# Altium project IBB.PrjPcb (part 9 of 12)
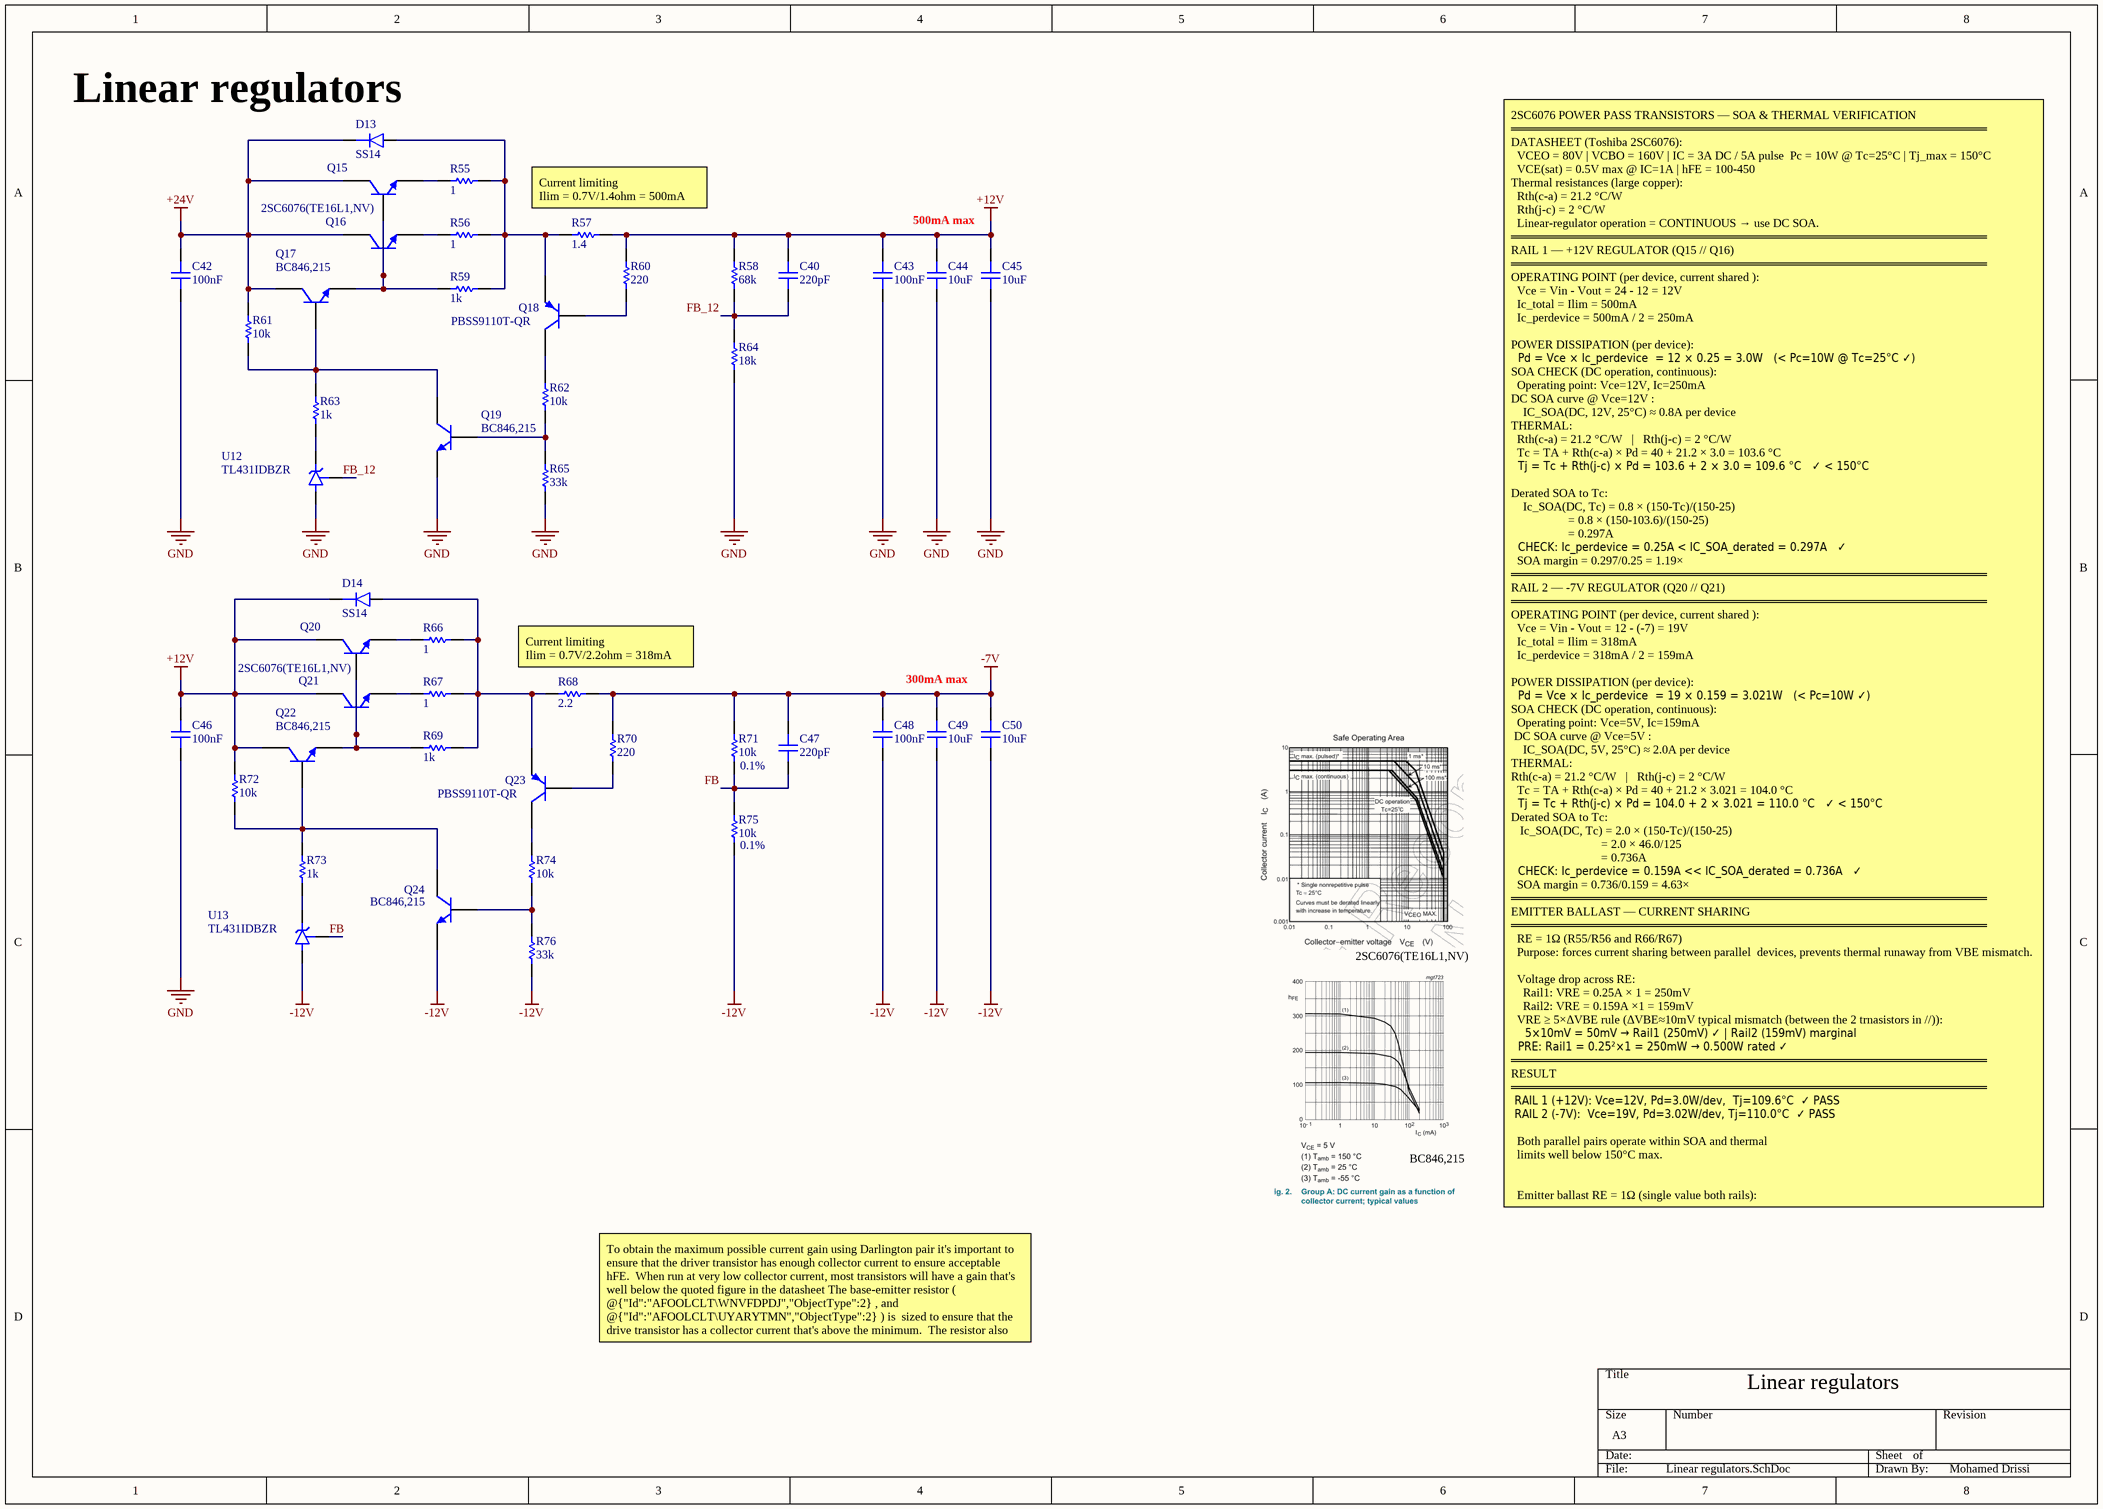
[diagram p14: Linear regulators.SchDoc]

## Sheet Linear regulators.SchDoc (continued)

### Library data of the parts (continued)
R68 = Bourns CRM1206-JW-2R2ELF: Res Thick Film 1206 2.2 Ohm 5% 0.5W(1/2W) ±200ppm/C Pad SMD T/R; Manufacturer: Bourns; Max Power Dissipation: 500mW; Temperature Coefficient: 200ppm/°C; Voltage Rating: 200V; Supplier: RS; Supplier Part Number: 630160; Manufacturer Part Number: CRM1206-JW-2R2ELF; RoHS: Compliant; Category: Chip SMD Resistors; Stock: 9920; Pricing: 20=0,049, 500=0,042, 2000=0,032, 10000=0,028, 20000=0,021 (EUR); Case/Package: 1206; Case Code (Imperial): 1206; Case Code (Metric): 3216; China RoHS: Non-Compliant; Composition: Thick Film; Country of Origin: Taiwan; Depth: 1.6mm; Export Control Classification Number (ECCN) Code: EAR99; Height: 550µm; Harmonized Tariff Schedule (HTS) Code: 8533.21.00.30; Introduction Date: 2011-02-17; Length: 3.1mm; Lifecycle Status: Production; Max Operating Temperature: 155°C; Military Standard: Not; Min Operating Temperature: -55°C; Mounting Technology: Surface Mount; Pins: 2; Number of Terminals: 2; Number of Terminations: 2; Packaging: Cut Tape; Power Rating: 500mW; REACH SVHC: Yes; Schedule B: 8533210045, 8533210045|8533210045, 8533210045|8533210045|8533210045, 8533210045|8533210045|8533210045|8533210045; Tolerance: 5%; Voltage Rating (DC): 200V; Width: 1.6mm; Working Voltage: 200V; ComponentLink1URL: https://datasheet.octopart.com:443/CRM1206-JW-2R2ELF-Bourns-datasheet-182141858.pdf?src-supplier=Master+Electronics; ComponentLink1Description: https://datasheet.octopart.com:443/CRM1206-JW-2R2ELF-Bourns-datasheet-182141858.pdf?src-supplier=Master+Electronics; ComponentLink2URL: https://datasheet.octopart.com:443/CRM1206-JW-2R2ELF-Bourns-datasheet-164353756.pdf?src-supplier=JRH+Electronics; ComponentLink2Description: https://datasheet.octopart.com:443/CRM1206-JW-2R2ELF-Bourns-datasheet-164353756.pdf?src-supplier=JRH+Electronics; ComponentLink3URL: https://datasheet.octopart.com:443/CRM1206-JW-2R2ELF-Bourns-datasheet-97424573.pdf?src-supplier=Burklin+Elektronik; ComponentLink3Description: https://datasheet.octopart.com:443/CRM1206-JW-2R2ELF-Bourns-datasheet-97424573.pdf?src-supplier=Burklin+Elektronik; ComponentLink4URL: https://datasheet.octopart.com:443/CRM1206-JW-2R2ELF-Bourns-datasheet-154729671.pdf?src-supplier=Electro+Sonic; ComponentLink4Description: https://datasheet.octopart.com:443/CRM1206-JW-2R2ELF-Bourns-datasheet-154729671.pdf?src-supplier=Electro+Sonic; ComponentLink5URL: https://datasheet.octopart.com:443/CRM1206-JW-2R2ELF-Bourns-datasheet-10026694.pdf?src-supplier=element14; ComponentLink5Description: https://datasheet.octopart.com:443/CRM1206-JW-2R2ELF-Bourns-datasheet-10026694.pdf?src-supplier=element14; ComponentLink6URL: https://datasheet.octopart.com:443/CRM1206-JW-2R2ELF-Bourns-datasheet-33021211.pdf?src-supplier=Newark; ComponentLink6Description: https://datasheet.octopart.com:443/CRM1206-JW-2R2ELF-Bourns-datasheet-33021211.pdf?src-supplier=Newark; ComponentLink7URL: https://datasheet.octopart.com:443/CRM1206-JW-2R2ELF-Bourns-datasheet-27379021.pdf?src-supplier=Newark; ComponentLink7Description: https://datasheet.octopart.com:443/CRM1206-JW-2R2ELF-Bourns-datasheet-27379021.pdf?src-supplier=Newark; ComponentLink8URL: https://datasheet.octopart.com:443/CRM1206-JW-2R2ELF-Bourns-datasheet-21196278.pdf?src-supplier=Newark; ComponentLink8Description: https://datasheet.octopart.com:443/CRM1206-JW-2R2ELF-Bourns-datasheet-21196278.pdf?src-supplier=Newark; ComponentLink9URL: http://sigma.octopart.com:80/conflict_mineral_statement/Bourns-company-36.pdf?src-supplier=Compliance+Statements; ComponentLink9Description: http://sigma.octopart.com:80/conflict_mineral_statement/Bourns-company-36.pdf?src-supplier=Compliance+Statements
U12 U13 = TI TL431IDBZR: V-Ref Adjustable 2.495V to 36V 100mA Automotive 3-Pin SOT-23 T/R; Manufacturer: Texas Instruments; Manufacturer Lifecycle Status: ACTIVE; Cathode Current: 1mA; Max Supply Voltage: 37V; Number of Channels: 1; Reference Type: Adjustable, Shunt; Temperature Coefficient: 34ppm/°C; Tolerance: 2%; Supplier: Arrow Electronics; Supplier Part Number: TL431IDBZR; Manufacturer Part Number: TL431IDBZR; RoHS: Compliant; Category: Voltage References; Stock: 51000; Pricing: 3000=0,0918, 6000=0,0907, 9000=0,0882, 15000=0,0874, 21000=0,0865, 30000=0,0823 (USD); Case/Package: SOT-23; Height: 1.22mm; Lead Free: Lead Free; Length: 2.92mm; Lifecycle Status: Production; Max Operating Temperature: 85°C; Max Output current: 100mA; Max Output Voltage: 36V; Min Input Voltage: 2.495V; Min Operating Temperature: -40°C; Pins: 3; Output Current: 100mA; Output Voltage: 36V; Packaging: Cut Tape; Radiation Hardening: No; REACH SVHC: No; Reference Voltage: 36V; Schedule B: 8542390000, 8542390000|8542390000|8542390000|8542390000|8542390000; Thickness: 1mm; Weight: 1.437803g; Width: 1.3mm; ComponentLink1URL: https://sigma.octopart.com:443/179129137/technical_drawing/Texas-Instruments-TL431IDBZR.pdf?src-supplier=Texas+Instruments; ComponentLink1Description: https://sigma.octopart.com:443/179129137/technical_drawing/Texas-Instruments-TL431IDBZR.pdf?src-supplier=Texas+Instruments; ComponentLink2URL: https://octopart.com:443/opatz8j6/c1?t=rW6bIrba_jbvmB_uabgQ4DHQ_8bXebmw5n36TFgajg_cM10sTUMOa3c0_aROWTzNuODAPxgdzkUCyLMyjqW5ECfNLnsPaaELSSqte_UXEwTAXn63sCq0zOIbeu3rbiILGc0xAKExe2TPYtg5Ms4ml5aZB-hP2d9WeynMm8uqMp-0nIZVL-dEP5eqV8i1QpquQEXyisrE4V8pFSHbvg01nxHcb9gAO0LAPA1OgW6fj5N8dHmskhhoOlj6gaEdyF9jXEJmJUbnrXDzuao32M8w1z1jkibRnCgcbwk3b-Z8PYiflKC4Jzxffmw6AAaWjNeE2_Iqkn9MenYhHERA89N4870fEFKw1TPybVjTNvPhj-8IMEBDTyhXkE4nZuLn3P6NpQ&src-supplier=Texas+Instruments; ComponentLink2Description: https://octopart.com:443/opatz8j6/c1?t=rW6bIrba_jbvmB_uabgQ4DHQ_8bXebmw5n36TFgajg_cM10sTUMOa3c0_aROWTzNuODAPxgdzkUCyLMyjqW5ECfNLnsPaaELSSqte_UXEwTAXn63sCq0zOIbeu3rbiILGc0xAKExe2TPYtg5Ms4ml5aZB-hP2d9WeynMm8uqMp-0nIZVL-dEP5eqV8i1QpquQEXyisrE4V8pFSHbvg01nxHcb9gAO0LAPA1OgW6fj5N8dHmskhhoOlj6gaEdyF9jXEJmJUbnrXDzuao32M8w1z1jkibRnCgcbwk3b-Z8PYiflKC4Jzxffmw6AAaWjNeE2_Iqkn9MenYhHERA89N4870fEFKw1TPybVjTNvPhj-8IMEBDTyhXkE4nZuLn3P6NpQ&src-supplier=Texas+Instruments; ComponentLink3URL: https://sigma.octopart.com:443/169406038/technical_drawing/Texas-Instruments-TL431IDBZR.pdf?src-supplier=Texas+Instruments; ComponentLink3Description: https://sigma.octopart.com:443/169406038/technical_drawing/Texas-Instruments-TL431IDBZR.pdf?src-supplier=Texas+Instruments; ComponentLink4URL: https://sigma.octopart.com:443/80351974/technical_drawing/Texas-Instruments-TL431IDBZR.pdf?src-supplier=Texas+Instruments; ComponentLink4Description: https://sigma.octopart.com:443/80351974/technical_drawing/Texas-Instruments-TL431IDBZR.pdf?src-supplier=Texas+Instruments; ComponentLink5URL: https://sigma.octopart.com:443/78374974/technical_drawing/Texas-Instruments-TL431IDBZR.pdf?src-supplier=Texas+Instruments; ComponentLink5Description: https://sigma.octopart.com:443/78374974/technical_drawing/Texas-Instruments-TL431IDBZR.pdf?src-supplier=Texas+Instruments; ComponentLink6URL: https://datasheet.octopart.com:443/TL431IDBZR-Texas-Instruments-datasheet-41217836.pdf?src-supplier=Texas+Instruments; ComponentLink6Description: https://datasheet.octopart.com:443/TL431IDBZR-Texas-Instruments-datasheet-41217836.pdf?src-supplier=Texas+Instruments; ComponentLink7URL: https://datasheet.octopart.com:443/TL431IDBZR-Texas-Instruments-datasheet-37140784.pdf?src-supplier=Texas+Instruments; ComponentLink7Description: https://datasheet.octopart.com:443/TL431IDBZR-Texas-Instruments-datasheet-37140784.pdf?src-supplier=Texas+Instruments; ComponentLink8URL: https://datasheet.octopart.com:443/TL431IDBZR-Texas-Instruments-datasheet-22066926.pdf?src-supplier=Texas+Instruments; ComponentLink8Description: https://datasheet.octopart.com:443/TL431IDBZR-Texas-Instruments-datasheet-22066926.pdf?src-supplier=Texas+Instruments; ComponentLink9URL: https://datasheet.octopart.com:443/TL431IDBZR-Texas-Instruments-datasheet-11514612.pdf?src-supplier=Texas+Instruments; ComponentLink9Description: https://datasheet.octopart.com:443/TL431IDBZR-Texas-Instruments-datasheet-11514612.pdf?src-supplier=Texas+Instruments; ComponentLink10URL: https://datasheet.octopart.com:443/TL431IDBZR-Texas-Instruments-datasheet-149617.pdf?src-supplier=Texas+Instruments; ComponentLink10Description: https://datasheet.octopart.com:443/TL431IDBZR-Texas-Instruments-datasheet-149617.pdf?src-supplier=Texas+Instruments; ComponentLink11URL: https://sigma.octopart.com:443/49250660/technical_drawing/Texas-Instruments-TL431IDBZR.pdf?src-supplier=Texas+Instruments; ComponentLink11Description: https://sigma.octopart.com:443/49250660/technical_drawing/Texas-Instruments-TL431IDBZR.pdf?src-supplier=Texas+Instruments; ComponentLink12URL: https://datasheet.octopart.com:443/TL431IDBZR-Texas-Instruments-datasheet-10255933.pdf?src-supplier=Texas+Instruments; ComponentLink12Description: https://datasheet.octopart.com:443/TL431IDBZR-Texas-Instruments-datasheet-10255933.pdf?src-supplier=Texas+Instruments; ComponentLink13URL: https://datasheet.octopart.com:443/TL431IDBZR-Texas-Instruments-datasheet-81843928.pdf?src-supplier=Upverter; ComponentLink13Description: https://datasheet.octopart.com:443/TL431IDBZR-Texas-Instruments-datasheet-81843928.pdf?src-supplier=Upverter; ComponentLink14URL: https://datasheet.octopart.com:443/TL431IDBZR-Texas-Instruments-datasheet-14437413.pdf?src-supplier=Upverter; ComponentLink14Description: https://datasheet.octopart.com:443/TL431IDBZR-Texas-Instruments-datasheet-14437413.pdf?src-supplier=Upverter; ComponentLink15URL: https://datasheet.octopart.com:443/TL431IDBZR-Texas-Instruments-datasheet-66581701.pdf?src-supplier=Farnell; ComponentLink15Description: https://datasheet.octopart.com:443/TL431IDBZR-Texas-Instruments-datasheet-66581701.pdf?src-supplier=Farnell; ComponentLink16URL: https://datasheet.octopart.com:443/TL431IDBZR-Texas-Instruments-datasheet-165804567.pdf?src-supplier=LCSC; ComponentLink16Description: https://datasheet.octopart.com:443/TL431IDBZR-Texas-Instruments-datasheet-165804567.pdf?src-supplier=LCSC; ComponentLink17URL: https://datasheet.octopart.com:443/TL431IDBZR-Texas-Instruments-datasheet-159117715.pdf?src-supplier=LCSC; ComponentLink17Description: https://datasheet.octopart.com:443/TL431IDBZR-Texas-Instruments-datasheet-159117715.pdf?src-supplier=LCSC; ComponentLink18URL: https://datasheet.octopart.com:443/TL431IDBZR-Texas-Instruments-datasheet-164418451.pdf?src-supplier=SHENGYU+ELECTRONICS; ComponentLink18Description: https://datasheet.octopart.com:443/TL431IDBZR-Texas-Instruments-datasheet-164418451.pdf?src-supplier=SHENGYU+ELECTRONICS; ComponentLink19URL: https://datasheet.octopart.com:443/TL431IDBZR-Texas-Instruments-datasheet-95954503.pdf?src-supplier=TME; ComponentLink19Description: https://datasheet.octopart.com:443/TL431IDBZR-Texas-Instruments-datasheet-95954503.pdf?src-supplier=TME; ComponentLink20URL: https://datasheet.octopart.com:443/TL431IDBZR-Texas-Instruments-datasheet-137316104.pdf?src-supplier=Future+Electronics; ComponentLink20Description: https://datasheet.octopart.com:443/TL431IDBZR-Texas-Instruments-datasheet-137316104.pdf?src-supplier=Future+Electronics; ComponentLink21URL: https://datasheet.octopart.com:443/TL431IDBZR-Texas-Instruments-datasheet-38226331.pdf?src-supplier=Newark; ComponentLink21Description: https://datasheet.octopart.com:443/TL431IDBZR-Texas-Instruments-datasheet-38226331.pdf?src-supplier=Newark; ComponentLink22URL: https://datasheet.octopart.com:443/TL431IDBZR-Texas-Instruments-datasheet-37140351.pdf?src-supplier=Newark; ComponentLink22Description: https://datasheet.octopart.com:443/TL431IDBZR-Texas-Instruments-datasheet-37140351.pdf?src-supplier=Newark; ComponentLink23URL: https://datasheet.octopart.com:443/TL431IDBZR-Texas-Instruments-datasheet-33011757.pdf?src-supplier=Newark; ComponentLink23Description: https://datasheet.octopart.com:443/TL431IDBZR-Texas-Instruments-datasheet-33011757.pdf?src-supplier=Newark; ComponentLink24URL: https://datasheet.octopart.com:443/TL431IDBZR-Texas-Instruments-datasheet-10882568.pdf?src-supplier=Arrow+Electronics; ComponentLink24Description: https://datasheet.octopart.com:443/TL431IDBZR-Texas-Instruments-datasheet-10882568.pdf?src-supplier=Arrow+Electronics; ComponentLink25URL: https://datasheet.octopart.com:443/TL431IDBZR-Texas-Instruments-datasheet-10218417.pdf?src-supplier=element14; ComponentLink25Description: https://datasheet.octopart.com:443/TL431IDBZR-Texas-Instruments-datasheet-10218417.pdf?src-supplier=element14; ComponentLink26URL: https://datasheet.octopart.com:443/TL431IDBZR-Texas-Instruments-datasheet-10027895.pdf?src-supplier=element14; ComponentLink26Description: https://datasheet.octopart.com:443/TL431IDBZR-Texas-Instruments-datasheet-10027895.pdf?src-supplier=element14; ComponentLink27URL: https://datasheet.octopart.com:443/TL431IDBZR-Texas-Instruments-datasheet-8886313.pdf?src-supplier=element14; ComponentLink27Description: https://datasheet.octopart.com:443/TL431IDBZR-Texas-Instruments-datasheet-8886313.pdf?src-supplier=element14; ComponentLink28URL: https://datasheet.octopart.com:443/TL431IDBZR-Texas-Instruments-datasheet-8826676.pdf?src-supplier=element14; ComponentLink28Description: https://datasheet.octopart.com:443/TL431IDBZR-Texas-Instruments-datasheet-8826676.pdf?src-supplier=element14; ComponentLink29URL: https://datasheet.octopart.com:443/TL431IDBZR-Texas-Instruments-datasheet-8735770.pdf?src-supplier=element14; ComponentLink29Description: https://datasheet.octopart.com:443/TL431IDBZR-Texas-Instruments-datasheet-8735770.pdf?src-supplier=element14; ComponentLink30URL: https://datasheet.octopart.com:443/TL431IDBZR-Texas-Instruments-datasheet-8724803.pdf?src-supplier=element14; ComponentLink30Description: https://datasheet.octopart.com:443/TL431IDBZR-Texas-Instruments-datasheet-8724803.pdf?src-supplier=element14; ComponentLink31URL: https://datasheet.octopart.com:443/TL431IDBZR-Texas-Instruments-datasheet-8463480.pdf?src-supplier=element14; ComponentLink31Description: https://datasheet.octopart.com:443/TL431IDBZR-Texas-Instruments-datasheet-8463480.pdf?src-supplier=element14; ComponentLink32URL: https://datasheet.octopart.com:443/TL431IDBZR-Texas-Instruments-datasheet-7546206.pdf?src-supplier=element14; ComponentLink32Description: https://datasheet.octopart.com:443/TL431IDBZR-Texas-Instruments-datasheet-7546206.pdf?src-supplier=element14; ComponentLink33URL: https://datasheet.octopart.com:443/TL431IDBZR-Texas-Instruments-datasheet-5314698.pdf?src-supplier=element14; ComponentLink33Description: https://datasheet.octopart.com:443/TL431IDBZR-Texas-Instruments-datasheet-5314698.pdf?src-supplier=element14; ComponentLink34URL: https://datasheet.octopart.com:443/TL431IDBZR-Texas-Instruments-datasheet-8441549.pdf?src-supplier=Jameco; ComponentLink34Description: https://datasheet.octopart.com:443/TL431IDBZR-Texas-Instruments-datasheet-8441549.pdf?src-supplier=Jameco; ComponentLink35URL: https://datasheet.octopart.com:443/TL431IDBZR-Texas-Instruments-datasheet-153618.pdf?src-supplier=Mouser; ComponentLink35Description: https://datasheet.octopart.com:443/TL431IDBZR-Texas-Instruments-datasheet-153618.pdf?src-supplier=Mouser; ComponentLink36URL: https://datasheet.octopart.com:443/TL431IDBZR-Texas-Instruments-datasheet-3065.pdf?src-supplier=DigiKey; ComponentLink36Description: https://datasheet.octopart.com:443/TL431IDBZR-Texas-Instruments-datasheet-3065.pdf?src-supplier=DigiKey; ComponentLink37URL: https://datasheet.octopart.com:443/TL431IDBZR-Texas-Instruments-datasheet-112754.pdf?src-supplier=Sierra+IC; ComponentLink37Description: https://datasheet.octopart.com:443/TL431IDBZR-Texas-Instruments-datasheet-112754.pdf?src-supplier=Sierra+IC; ComponentLink38URL: http://sigma.octopart.com:80/reach_statement/Texas-Instruments-company-64.pdf?src-supplier=Compliance+Statements; ComponentLink38Description: http://sigma.octopart.com:80/reach_statement/Texas-Instruments-company-64.pdf?src-supplier=Compliance+Statements; ComponentLink39URL: http://sigma.octopart.com:80/conflict_mineral_statement/Texas-Instruments-company-63.pdf?src-supplier=Compliance+Statements; ComponentLink39Description: http://sigma.octopart.com:80/conflict_mineral_statement/Texas-Instruments-company-63.pdf?src-supplier=Compliance+Statements

## Sheet Control circuit.SchDoc
size A4; SheetNumber: 3; SheetTotal: 8
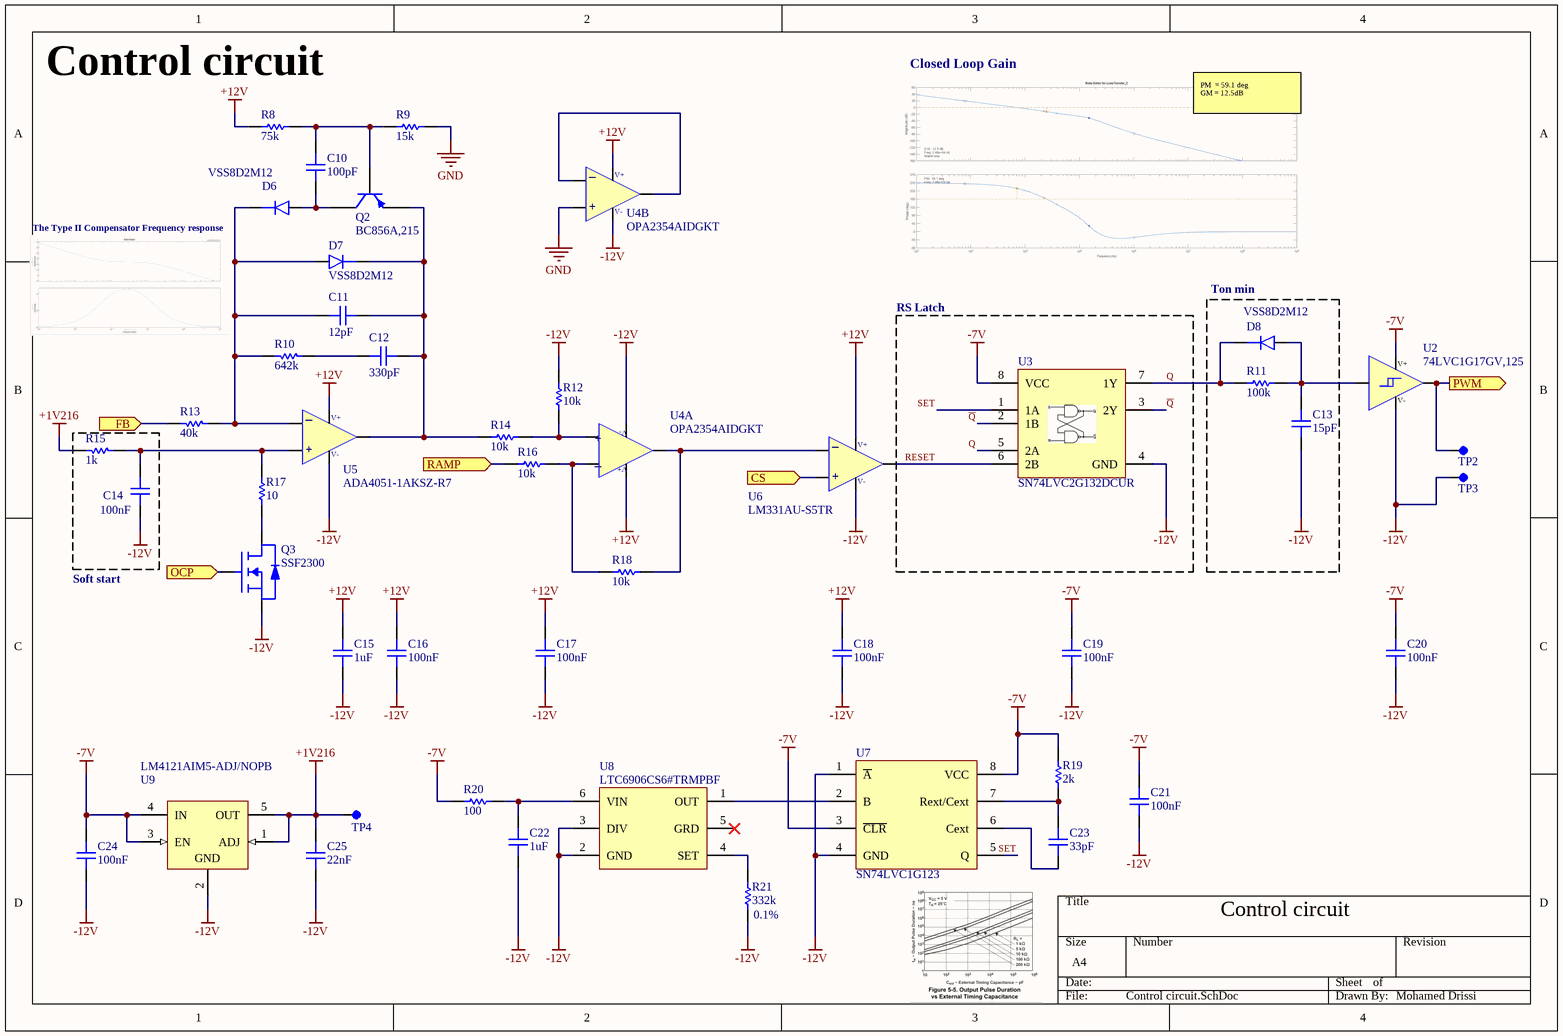
[diagram p7: Control circuit.SchDoc]

### Parts
C10  Capacitance: 100pF  [Cap_0603]  (hidden comment: GCM1885C2A101JA16D)
C11  Capacitance: 12pF  [cap_0603]  (hidden comment: VJ0603A120KXJCW1BC)
C12  Capacitance: 330pF  [Cap_0603]  (hidden comment: 885012006026)
C13  Capacitance: 15pF  [cap_0603]  (hidden comment: CL10C150JC81PNC)
C14  Capacitance: 100nF  [cap_0603]  (hidden comment: GMC10X7R104K100NT)
C15  Capacitance: 1uF  [cap_1206]  (hidden comment: 885382208005)
C16  Capacitance: 100nF  [cap_0603]  (hidden comment: GMC10X7R104K100NT)
C17  Capacitance: 100nF  [cap_0603]  (hidden comment: GMC10X7R104K100NT)
C18  Capacitance: 100nF  [cap_0603]  (hidden comment: GMC10X7R104K100NT)
C19  Capacitance: 100nF  [cap_0603]  (hidden comment: GMC10X7R104K100NT)
C20  Capacitance: 100nF  [cap_0603]  (hidden comment: GMC10X7R104K100NT)
C21  Capacitance: 100nF  [cap_0603]  (hidden comment: GMC10X7R104K100NT)
C22  Capacitance: 1uF  [cap_0603]  (hidden comment: CL10B105KA8NNNC)
C23  Capacitance: 33pF  [cap_0603]  (hidden comment: CL10C330JB8NNNC)
C24  Capacitance: 100nF  [cap_0603]  (hidden comment: GMC10X7R104K100NT)
C25  Capacitance: 22nF  [cap_0603]  (hidden comment: C0603C223K4RACTU)
D6  VSS8D2M12  [DO-221AD]
D7  VSS8D2M12  [DO-221AD]
D8  VSS8D2M12  [DO-221AD]
Q2  BC856A,215  [sot23]
Q3  SSF2300  [SOT-23-3]
R8  Resistance: 75k  [Res_0603]  (hidden comment: CRCW060375K0FKEAC)
R9  Resistance: 15k  [Res_0603]  (hidden comment: RC0603FR-0715KL)
R10  value 642k  [res_0603]  (hidden comment: RN73H1JTTD6423B50)
R11  Resistance: 100k  [res_0603]  (hidden comment: CRCW0603100KFKEA)
R12  Resistance: 10k  [res_0603]  (hidden comment: ERA-3AEB103V)
R13  value 40k  [Res_0603]  (hidden comment: AT0603BRD0740KL)
R14  Resistance: 10k  [res_0603]  (hidden comment: ERA-3AEB103V)
R15  Resistance: 1k  [res_0603]  (hidden comment: RC0603FR-071KL)
R16  Resistance: 10k  [res_0603]  (hidden comment: ERA-3AEB103V)
R17  Resistance: 10  [res_0603]  (hidden comment: RC0603FR-0710RL)
R18  Resistance: 10k  [res_0603]  (hidden comment: ERA-3AEB103V)
R19  Resisitance: 2k  [res_0603]  (hidden comment: RT0603BRD072KL)
R20  Resistance: 100  [res_0603]  (hidden comment: RC0603FR-07100RL)
R21  Tolerance: 0.1%  Resistance: 332k  [res_0603]  (hidden comment: RT0603BRD07332KL)
TP2  5000  [TH TP]  (value not drawn)
TP3  5000  [TH TP]  (value not drawn)
TP4  5000  [TH TP]  (value not drawn)
U2  74LVC1G17GV,125  [SOT353-1]
U3  SN74LVC2G132DCUR  [8-VSSOP]
U4  OPA2354AIDGKT  [TSOP, 8-Leads]  (parts A,B of 2)
U5  ADA4051-1AKSZ-R7  [5-Lead SOT-23]
U6  LM331AU-S5TR  [5-Lead SOT-23]
U7  SN74LVC1G123  [8-VSSOP]
U8  LTC6906CS6#TRMPBF  [sot23-6]
U9  LM4121AIM5-ADJ/NOPB  [5-Lead SOT-23]

### Blocks framed on the sheet
Ton min: C13 D8 R11
RS Latch: U3

### Ports
CS (in, see Main[3C], current sense[3B], Protections[4A]), FB (in, see Main[4C]), OCP (in, see Main[3C], Protections[4C]), PWM (out, see Main[3C], Power stage[3C]), RAMP (in, see Main[3C])

### Nets
+1V216: C25.2 R15.2 TP4.1 U9.1(ADJ) U9.5(OUT)
+12V: C15.1 C16.2 C17.2 C18.2 R8.1 U4.8(V+) U5.5(V+) U6.5(V+)
-7V: C19.2 C20.2 C21.2 C24.2 R19.2 R20.1 U2.5(V+) U3.8(VCC) U7.3(~{CLR}) U7.8(VCC) U9.3(EN) U9.4(IN)
-12V: C13.1 C14.1 C15.2 C16.1 C17.1 C18.1 C19.1 C20.1 C21.1 C22.1 C24.1 C25.1 Q3.1(S) R12.2 R21.1 TP3.1 U2.3(V-) U3.4(GND) U4.4(V-) U5.2(V-) U6.2(V-) U7.1(~{A}) U7.4(GND) U8.2(GND) U8.3(DIV) U9.2(GND)
GND: R9.2 U4.5(IN-)
Q: D8.C R11.1 U3.5(2A) U3.7(1Y)
~{Q}: U3.2(1B) U3.3(2Y)
RESET: U3.6(2B) U6.4(OUT)
SET: U3.1(1A) U7.5(Q)
NetC10_1: C10.1 D6.A Q2.3(C)
NetC10_2: C10.2 Q2.1(B) R8.2 R9.1
NetC11_1: C11.1 C12.1 D7.C Q2.2(E) R14.1 U5.4(OUT)
NetC11_2: C11.2 D6.C D7.A R10.2 R13.1 U5.3(IN+)
NetC12_2: C12.2 R10.1
NetC13_2: C13.2 D8.A R11.2 U2.2(A)
NetC14_2: C14.2 R15.1 R17.2 U5.1(IN-)
NetC22_2: C22.2 R20.2 U8.6(VIN)
NetC23_1: C23.1 U7.6(Cext)
NetC23_2: C23.2 R19.1 U7.7(Rext/Cext)
NetJ6_2: R16.1 ; port RAMP
NetQ3_2: Q3.2(G) ; port OCP
NetQ3_3: Q3.3(D) R17.1
NetR1_1: R13.2 ; port FB
NetR12_1: R12.1 R14.2 U4.3(IN-)
NetR16_2: R16.2 R18.1 U4.2(IN+)
NetR18_2: R18.2 U4.1(OUT) U6.3(IN+)
NetR21_2: R21.2 U8.4(SET)
NetR77_2: TP2.1 U2.4(Y) ; port PWM
NetU4_6: U4.6(IN+) U4.7(OUT)
NetU6_1: U6.1(IN-) ; port CS
NetU7_2: U7.2(B) U8.1(OUT)

Not connected (* = marked no-connect by the designer): U8 5(GRD)*

### Notes on the sheet
- Control circuit
- Closed Loop Gain
- PM  = 59.1 deg
  GM = 12.5dB
- (near D6) The Type II Compensator Frequency response
- Soft start
- Mohamed Drissi
- (in symbol 3Peak LM331AU-S5TR) _; +
- (in symbol Analog Device ADA4051-1AKSZ-R7) _; +
- (in symbol TI OPA2354AIDGKT, part B) _; +